# EAGLE design bigboard (EAGLE 9.5.2)
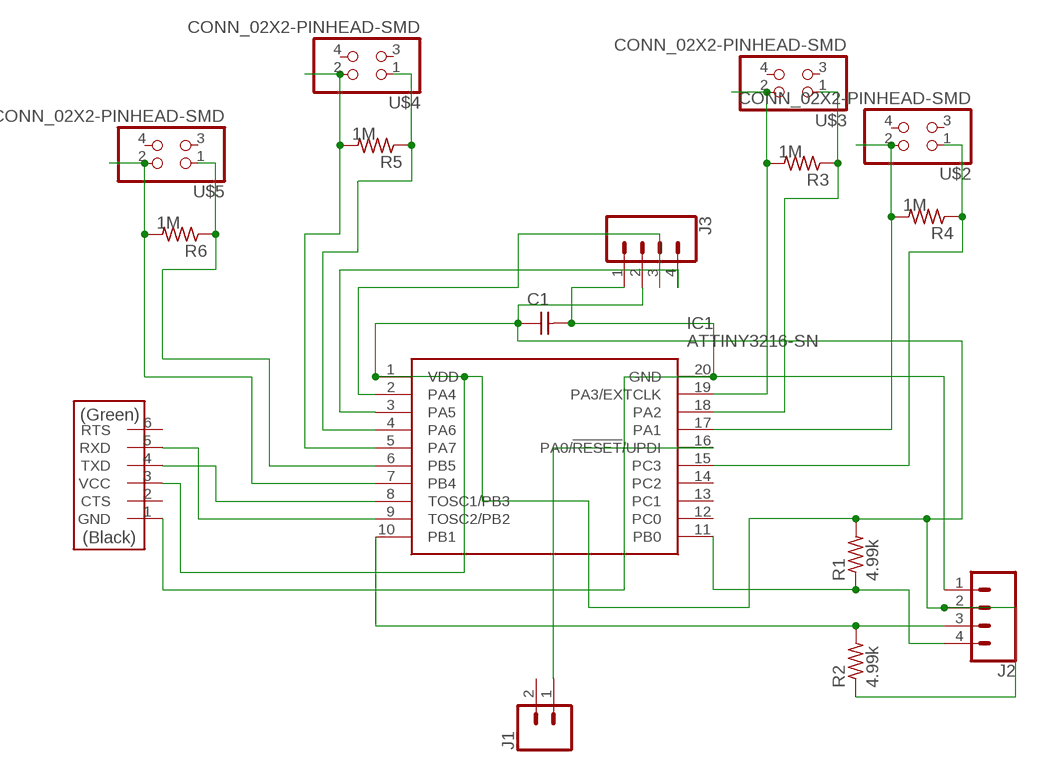
[diagram p0: schematic, sheet 1]

## Parts
C1  CAP_UNPOLARIZEDFAB  [C1206FAB]
IC1  ATTINY3216-SN  [SOIC127P1030X265-20N]
J1  CONN_02LOCK_LONGPADS  [1X02_LOCK_LONGPADS]
J2  CONN_04SMD_LONG  [1X04_SMD_LONG]
J3  CONN_04SMD_LONG  [1X04_SMD_LONG]
R1  4.99k  R1206FAB  [R1206FAB]
R2  4.99k  R1206FAB  [R1206FAB]
R3  R1206FAB  [R1206FAB]
R4  R1206FAB  [R1206FAB]
R5  R1206FAB  [R1206FAB]
R6  R1206FAB  [R1206FAB]
U$1  CONN_06_FTDI-SMD-HEADER  [1X06SMD]
U$2  CONN_02X2-PINHEAD-SMD  [2X02SMD]
U$3  CONN_02X2-PINHEAD-SMD  [2X02SMD]
U$4  CONN_02X2-PINHEAD-SMD  [2X02SMD]
U$5  CONN_02X2-PINHEAD-SMD  [2X02SMD]

## Nets
N$1: IC1.17(PA1) R4.2 U$2.2
N$2: IC1.15(PC3) R4.1 U$2.1
N$3: IC1.19(PA3/EXTCLK) R3.2 U$3.2
N$4: IC1.18(PA2) R3.1 U$3.1
N$5: IC1.5(PA7) R5.2 U$4.2
N$6: IC1.4(PA6) R5.1 U$4.1
N$7: IC1.7(PB4) R6.2 U$5.2
N$8: IC1.6(PB5) R6.1 U$5.1
N$9: IC1.9(TOSC2/PB2) U$1.5(RXD)
N$10: C1.2 IC1.20(GND) J2.1 J3.1 U$1.1(GND)
N$11: IC1.16(PA0/!RESET!/UPDI) J1.1
N$12: IC1.2(PA4) J3.3
N$13: IC1.3(PA5) J3.4
N$14: IC1.10(PB1) J2.3 R2.2
N$15: C1.1 IC1.1(VDD) J2.2 J3.2 R1.2 R2.1 U$1.3(VCC)
N$16: IC1.11(PB0) J2.4 R1.1
N$21: IC1.8(TOSC1/PB3) U$1.4(TXD)
Unconnected: IC1.12(PC0) IC1.13(PC1) IC1.14(PC2) J1.2 U$1.2(CTS) U$1.6(RTS) U$2.3 U$2.4 U$3.3 U$3.4 U$4.3 U$4.4 U$5.3 U$5.4

## Library data of the parts
C1 = fab_new:CAP_UNPOLARIZED
IC1 = ATTINY3216-SN:ATTINY3216-SN: MICROCHIP - ATTINY3216-SN - 8 Bit MCU, AVR Family ATtiny3216 Series Microcontrollers, 20 MHz, 32 KB, 2 KB, 20 Pins, SOIC Source: Datasheet <https://componentsearchengine.com/Datasheets/1/ATTINY3216-SN.pdf>; AVAILABILITY: Unavailable; DESCRIPTION: AVR tinyAVR™ 1 Microcontroller IC 8-Bit 20MHz 32KB _32K x 8_ FLASH 20-SOIC; MF: Microchip Technology; MP: ATTINY3216-SN; PACKAGE: SOIC-20 Microchip Technology; PRICE: None
J1 = SparkFun-Connectors:CONN_02: Multi connection point. Often used as Generic Header-pin footprint for 0.1 inch spaced/style header connections On any of the 0.1 inch spaced packages, you can populate with these: Break Away Headers - Straight <https://www.sparkfun.com/products/116> (PRT-00116) Break Away Male Headers - Right Angle <https://www.sparkfun.com/products/553> (PRT-00553) Female Headers <https://www.sparkfun.com/products/115> (PRT-00115) Break Away Headers - Machine Pin <https://www.sparkfun.com/products/117> (PRT-00117) Break Away Female Headers - Swiss Machine Pin <https://www.sparkfun.com/products/743> (PRT-00743) For SCREWTERMINALS and SPRING TERMINALS visit here: Screw Terimnals on SparkFun.com <https://www.sparkfun.com/search/results?term=Screw+Terminals> (5mm/3.5mm/2.54mm spacing) This device is also useful as a general connection point to wire up your design to another part of your project. Our various solder wires solder well into these plated through hole pads. Hook-Up Wire - Assortment (Stranded, 22 AWG) <https://www.sparkfun.com/products/11375> (PRT-11375) Hook-Up Wire - Assortment (Solid Core, 22 AWG) <https://www.sparkfun.com/products/11367> (PRT-11367) View the entire wire category on our website here <https://www.sparkfun.com/categories/141> Special notes: Molex polarized connector foot print use with: PRT-08233 with associated crimp pins and housings. 2.54_SCREWTERM for use with PRT-10571. 3.5mm Screw Terminal footprints for PRT-08084 5mm Screw Terminal footprints for use with PRT-08432
J2 J3 = SparkFun-Connectors:CONN_04: Multi connection point. Often used as Generic Header-pin footprint for 0.1 inch spaced/style header connections On any of the 0.1 inch spaced packages, you can populate with these: Break Away Headers - Straight <https://www.sparkfun.com/products/116> (PRT-00116) Break Away Male Headers - Right Angle <https://www.sparkfun.com/products/553> (PRT-00553) Female Headers <https://www.sparkfun.com/products/115> (PRT-00115) Break Away Headers - Machine Pin <https://www.sparkfun.com/products/117> (PRT-00117) Break Away Female Headers - Swiss Machine Pin <https://www.sparkfun.com/products/743> (PRT-00743) For SCREWTERMINALS and SPRING TERMINALS visit here: Screw Terimnals on SparkFun.com <https://www.sparkfun.com/search/results?term=Screw+Terminals> (5mm/3.5mm/2.54mm spacing) This device is also useful as a general connection point to wire up your design to another part of your project. Our various solder wires solder well into these plated through hole pads. Hook-Up Wire - Assortment (Stranded, 22 AWG) <https://www.sparkfun.com/products/11375> (PRT-11375) Hook-Up Wire - Assortment (Solid Core, 22 AWG) <https://www.sparkfun.com/products/11367> (PRT-11367) View the entire wire category on our website here <https://www.sparkfun.com/categories/141> Special notes: Molex polarized connector foot print use with SKU : PRT-08231 with associated crimp pins and housings. 1MM SMD Version SKU: PRT-10208; PROD_ID: CONN-09140; SF_ID: PRT-12638
R1 R2 = fab_new:R: Resistor (US Symbol) Variants with postfix FAB are widened to allow the routing of internal traces
R3-R6 = fab_new:R: Resistor (US Symbol) Variants with postfix FAB are widened to allow the routing of internal traces; R1: 1M
U$1 = fab_new:CONN_06_FTDI-SMD-HEADER
U$2-U$5 = fab_new:CONN_02X2-PINHEAD-SMD

## Board
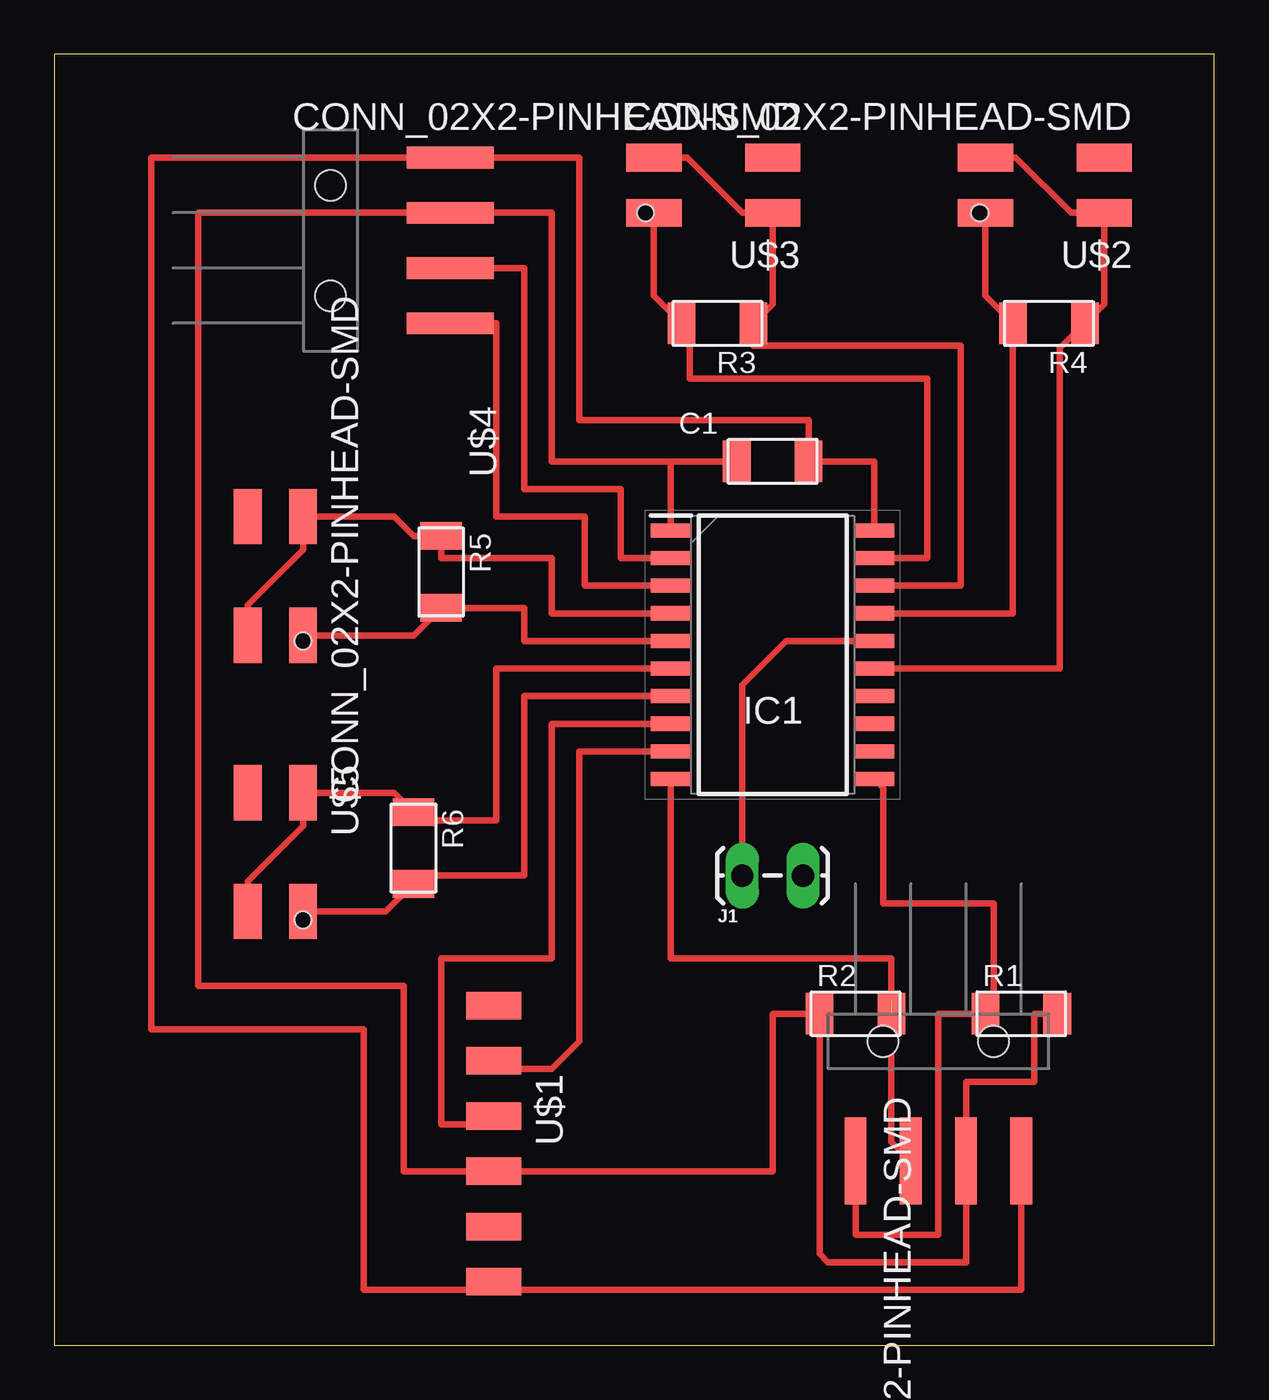
[diagram p1: board, top side]

Size 53.32 x 59.36 mm. Coordinates in mm from the lower left corner, seen from the top.
Outline: 0,0 53.32,0 53.32,59.36 0,59.36 0,0
Copper layers (1*16): Top 0.035mm / dielectric 1.5mm / Bottom 0.035mm
Design rules "default": minimum track width 6mil, minimum drill 0.35mm, track to track 6mil, track to pad 6mil, pad to pad 6mil, via to via 6mil, smd to smd 6mil, copper to edge 40mil, drill to drill 6mil, minimum pad ring 10mil, minimum via ring 8mil, stop-mask expansion 4mil, vias tented up to drill 0mil, thermal gap 10mil
Holes 0.76 mm at 11.43,19.56 11.43,32.38 42.55,52.07 27.18,52.07

### Footprints (pad centres in the part's own frame; a part is rotated, then mirrored left to right if it is on the bottom)
C1206FAB = smd 1.27 x 1.905: 1 -1.651,0; 2 1.651,0
SOIC127P1030X265-20N = smd 1.85 x 0.65: 1 -4.675,5.715; 2 -4.675,4.445; 3 -4.675,3.175; 4 -4.675,1.905; 5 -4.675,0.635; 6 -4.675,-0.635; 7 -4.675,-1.905; 8 -4.675,-3.175; 9 -4.675,-4.445; 10 -4.675,-5.715; 11 4.675,-5.715; 12 4.675,-4.445; 13 4.675,-3.175; 14 4.675,-1.905; 15 4.675,-0.635; 16 4.675,0.635; 17 4.675,1.905; 18 4.675,3.175; 19 4.675,4.445; 20 4.675,5.715
1X02_LOCK_LONGPADS = drill 1.016 long: 1 -0.127,0; 2 2.667,0
1X04_SMD_LONG = smd 1 x 4: 1 -3.81,5.5; 2 -1.27,5.5; 3 1.27,5.5; 4 3.81,5.5 | hole 1.4: -2.54,0; 2.54,0
R1206FAB = smd 1.27 x 1.905: 1 -1.651,0; 2 1.651,0
1X06SMD = smd 2.54 x 1.27: 1 0,6.35; 2 0,3.81; 3 0,1.27; 4 0,-1.27; 5 0,-3.81; 6 0,-6.35
2X02SMD = smd 2.54 x 1.27: 1 -2.54,1.27; 2 2.92,1.27; 3 -2.54,-1.27; 4 2.92,-1.27

### Placement (x,y rotation side)
C1  33.02,40.64 0 top
IC1  33.02,31.75 0 top
J1  31.75,21.59 0 top
J2  40.64,13.97 180 top
J3  12.7,50.8 270 top
R1  44.45,15.24 0 top
R2  36.83,15.24 0 top
R3  30.48,46.99 180 top
R4  45.72,46.99 180 top
R5  17.78,35.56 270 top
R6  16.51,22.86 270 top
U$1  20.19,9.27 180 top
U$2  45.72,53.34 180 top
U$3  30.48,53.34 180 top
U$4  10.16,35.56 270 top
U$5  10.16,22.86 270 top

### Tracks (layer width: path | path; a pad name or v marks a point on that pad's centre or on a via)
N$1
  Top 0.305: U$2.2 42.8,48.26 R4.2 44.07,33.66 IC1.17
N$2
  Top 0.305: IC1.15 46.23,31.11 46.23,45.85 R4.1 48.26,47.88 U$2.1 46.74,52.07 44.2,54.61 43.18,54.61
N$3
  Top 0.305: U$3.2 27.56,48.26 R3.2 29.21,46.61 29.21,44.45 40.13,44.45 40.13,36.2 IC1.19
N$4
  Top 0.305: IC1.18 41.66,34.92 41.66,45.97 32.13,45.97 R3.1 33.02,47.88 U$3.1 31.62,52.07 29.08,54.61 27.94,54.61
N$5
  Top 0.305: U$4.2 16.51,32.64 R5.2 21.59,33.91 21.59,32.38 IC1.5
N$6
  Top 0.305: IC1.4 22.86,33.66 22.86,36.2 17.78,36.2 R5.1 16.51,37.21 15.62,38.1 U$4.1 11.43,36.58 8.89,34.04 8.89,33.02
N$7
  Top 0.305: U$5.2 15.24,19.94 R6.2 16.89,21.59 21.59,21.59 21.59,29.84 IC1.7
N$8
  Top 0.305: IC1.6 20.32,31.11 20.32,24.13 16.89,24.13 R6.1 15.62,25.4 U$5.1 11.43,23.88 8.89,21.34 8.89,20.32
N$9
  Top 0.305: IC1.9 24.13,27.3 24.13,13.97 22.86,12.7 20.57,12.7 U$1.5
N$10
  Top 0.305: IC1.20 37.7,40.64 C1.2 34.67,42.55 24.13,42.55 24.13,54.61 J3.1 4.45,54.61 4.45,14.51 14.22,14.51 14.22,2.54 19.69,2.54 | U$1.1 19.69,2.54 | 19.69,2.54 44.45,2.54 J2.1
N$11
  Top 0.305: IC1.16 33.66,32.38 31.62,30.35 J1.1
N$12
  Top 0.305: J3.3 21.59,49.53 21.59,39.37 26.04,39.37 26.04,36.2 IC1.2
N$13
  Top 0.305: J3.4 20.32,46.99 20.32,38.1 24.38,38.1 24.38,34.92 IC1.3
N$14  (1 unrouted)
  Top 0.305: R2.2 38.48,9.36 J2.3 | IC1.10 28.34,17.78 38.48,17.78 38.48,15.84
N$15
  Top 0.305: IC1.1 28.34,40.64 | 28.34,40.64 C1.1 | R1.2 45.05,15.24 45.05,12.1 41.91,12.1 J2.2 41.91,3.81 35.56,3.81 35.18,4.19 R2.1 33.02,15.24 33.02,8 U$1.3 16.07,8 16.07,16.51 6.6,16.51 6.6,52.07 J3.2 22.86,52.07 22.86,40.64 28.34,40.64
N$16
  Top 0.305: J2.4 36.83,5.08 40.64,5.08 40.64,15.24 R1.1 42.8,15.84 43.18,16.22 43.18,20.32 38.1,20.32 38.1,25.63 IC1.11
N$21
  Top 0.305: IC1.8 22.86,28.57 22.86,17.78 17.78,17.78 17.78,10.16 19.81,10.16 U$1.4